# Altium schematic sheet Headers.SchDoc: Interact Lab Motherboard
size A4; DrawnBy: Ben Kazemi; DocumentNumber: 3; Revision: 1; SheetNumber: 3; SheetTotal: 3; PageSetup: Record=PageOptions|CenterHorizontal=True|CenterVertical=True|PrintScale=0.54|XCorrection=1.00|YCorrection=1.00|PrintKind=0|BorderSize=5000000|LeftOffset=0|BottomOffset=0|Orientation=2|PaperLength=1000|PaperWidth=1000|Scale=100|PaperSource=7|PrintQuality=-4|MediaType=1|DitherType=10|PaperKind=Letter|PrintScaleMode=1; Number: Headers to Daughterboard
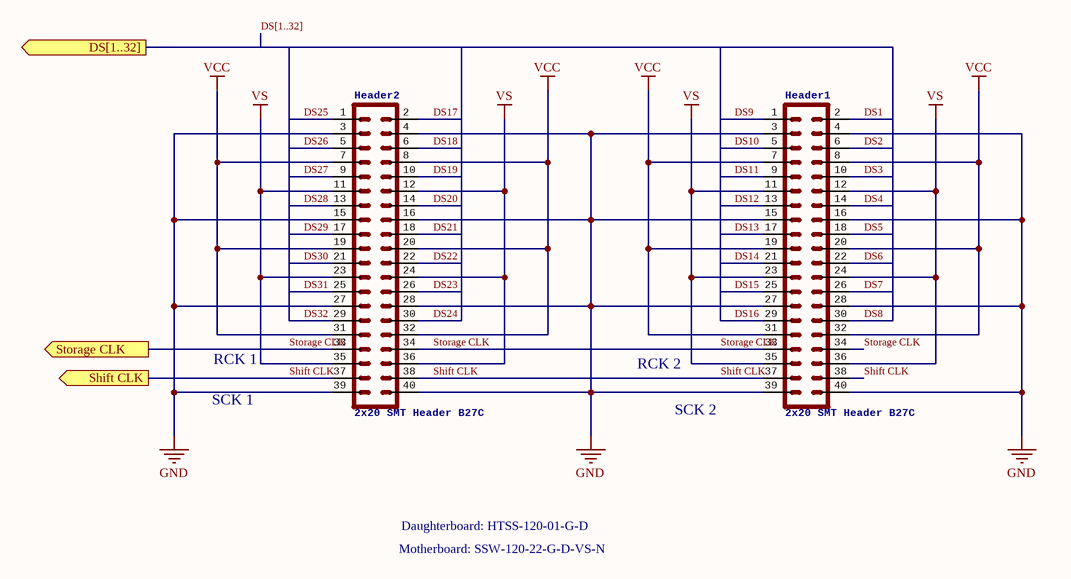
[diagram p0: Headers.SchDoc]

## Parts
Header1  2x20 SMT Header B27C  [B27C-SMT2x20]
Header2  2x20 SMT Header B27C  [B27C-SMT2x20]

## Ports
DS[1..32] (out), Shift CLK (out), Storage CLK (out)

## Nets
GND: Header1.3 Header1.4 Header1.15 Header1.16 Header1.27 Header1.28 Header1.39 Header1.40 Header2.3 Header2.4 Header2.15 Header2.16 Header2.27 Header2.28 Header2.39 Header2.40
VCC: Header1.7 Header1.8 Header1.19 Header1.20 Header1.31 Header1.32 Header2.7 Header2.8 Header2.19 Header2.20 Header2.31 Header2.32
VS: Header1.11 Header1.12 Header1.23 Header1.24 Header1.35 Header1.36 Header2.11 Header2.12 Header2.23 Header2.24 Header2.35 Header2.36
DS1: Header1.2
DS2: Header1.6
DS3: Header1.10
DS4: Header1.14
DS5: Header1.18
DS6: Header1.22
DS7: Header1.26
DS8: Header1.30
DS9: Header1.1
DS10: Header1.5
DS11: Header1.9
DS12: Header1.13
DS13: Header1.17
DS14: Header1.21
DS15: Header1.25
DS16: Header1.29
DS17: Header2.2
DS18: Header2.6
DS19: Header2.10
DS20: Header2.14
DS21: Header2.18
DS22: Header2.22
DS23: Header2.26
DS24: Header2.30
DS25: Header2.1
DS26: Header2.5
DS27: Header2.9
DS28: Header2.13
DS29: Header2.17
DS30: Header2.21
DS31: Header2.25
DS32: Header2.29
Shift CLK: Header1.37 Header1.38 Header2.37 Header2.38 ; port Shift CLK
Storage CLK: Header1.33 Header1.34 Header2.33 Header2.34 ; port Storage CLK

## Buses and harness runs
bus DS[1..32] = port DS[1..32]

## Notes on the sheet
- RCK 1
- RCK 2
- SCK 1
- SCK 2
- Motherboard: SSW-120-22-G-D-VS-N
- Daughterboard: HTSS-120-01-G-D

## Library data of the parts
Header1 Header2 = CONN_20X2SHROUDED_SMT: PROD_ID: B27C-2X20-BSBB1-G